# Altium schematic sheet Schema_Soldeerbout5.SchDoc
size A4; SheetNumber: 6; SheetTotal: 6
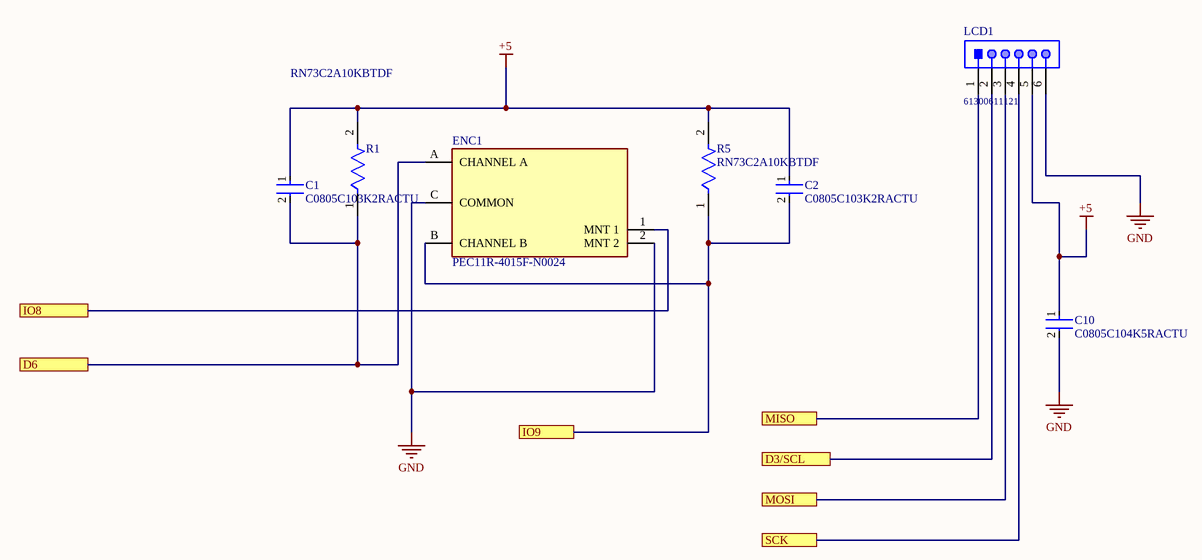
[diagram p0: Schema_Soldeerbout5.SchDoc]

## Parts
C1  C0805C103K2RACTU  [FP-C0805C-DN-MFG]
C2  C0805C103K2RACTU  [FP-C0805C-DN-MFG]
C10  C0805C104K5RACTU  [FP-C0805C-DN-MFG]
ENC1  PEC11R-4015F-N0024  [FP-PEC11R-4015F-N0024-MFG]
LCD1  61300611121  [61300611121]
R1  RN73C2A10KBTDF  [FP-RN732A-MFG]
R5  RN73C2A10KBTDF  [FP-RN732A-MFG]

## Ports
D3/SCL, D6, IO8, IO9, MISO, MOSI, SCK

## Nets
+5: C1.1 C2.1 C10.1 LCD1.5 R1.2 R5.2
GND: C10.2 ENC1.2(MNT_2) ENC1.C(COMMON) LCD1.6
D3/SCL: LCD1.2 ; port D3/SCL
D6: C1.2 ENC1.A(CHANNEL_A) R1.1 ; port D6
IO8: ENC1.1(MNT_1) ; port IO8
IO9: C2.2 ENC1.B(CHANNEL_B) R5.1 ; port IO9
MISO: LCD1.1 ; port MISO
MOSI: LCD1.3 ; port MOSI
SCK: LCD1.4 ; port SCK

## Library data of the parts
C1 C2 = CMP-2007-00259-2: CAP CER 10000PF 200V X7R 0805; Manufacturer: KEMET; Material: Ceramic; Temperature Coefficient: 30ppm/°C; Capacitance: 10,000 pF; Tolerance: 0.1; Value: 10,000 pF; Device Class L2: Capacitors; Voltage Rating: 200 V; Temperature Range High: +125°C; ComponentLink2Description: Datasheet; Height: 0.88mm; Octopart: https://octopart.com/c0805c103k2ractu-kemet-9138347; ComponentLink2URL: https://content.kemet.com/datasheets/KEM_C1003_C0G_SMD.pdf; Category: Cap; Temperature: -55°C to +125°C; Temperature Range Low: -55°C; Digikey Description: CAP CER 10000PF 200V X7R 0805; Manufacturer Part Number: C0805C103K2RACTU; Temperature Characteristic: X7R; Automotive: No; Device Class L3: Ceramic Capacitors; Mouser Description: KEMET - C0805C103K2RACTU - CAP, MLCC, X7R, 10NF, 200V, 0805; RoHS: TRUE; Device Class L1: Passive Components; Lead Free: Yes; Package: C0805C-DN; Ipc Land Pattern Name: CAPC200125X78
C10 = CMP-2007-00279-2: CAP CER 0.1UF 50V X7R 0805; Manufacturer: KEMET; Value: 0.10 μF; Tolerance: 0.1; Temperature Coefficient: 30ppm/°C; Material: Ceramic; Manufacturer Part Number: C0805C104K5RACTU; Device Class L2: Capacitors; Temperature Range Low: -55°C; Voltage Rating: 50 V; Digikey Description: CAP CER 0.1UF 50V X7R 0805; Category: Cap; ComponentLink2Description: Datasheet; Octopart: https://octopart.com/c0805c104k5ractu-kemet-143926; RoHS: TRUE; ComponentLink2URL: https://content.kemet.com/datasheets/KEM_C1003_C0G_SMD.pdf; Temperature Characteristic: X7R; Temperature: -55°C to +125°C; Height: 0.88mm; Temperature Range High: +125°C; Device Class L1: Passive Components; Automotive: No; Lead Free: Yes; Ipc Land Pattern Name: CAPC200125X78; Device Class L3: Ceramic Capacitors; Mouser Description: Cap Ceramic 0.1uF 50V X7R 10% SMD 2.0 x 1.2 mm 125 C Paper T/R; Capacitance: 0.10 μF; Package: C0805C-DN
ENC1 = CMP-07421-000003-1: ROTARY ENCODER MECHANICAL 24PPR; Manufacturer: Bourns; Current Rating: 10mA; Number Of Circuits: 1; Conn Orientation: Vertical; Encoder Type: Incremental; Detent: No; Pulses Per Rev: 24; Voltage Rating Dc: 5V; Manufacturer Part Number: PEC11R-4015F-N0024; Height: 22.3mm; ComponentLink2URL: https://www.bourns.com/docs/product-datasheets/pec11r.pdf?sfvrsn=bb617cbf_7; Mouser Description: Encoders 15mm SHAFT NO SWITCH; Package: 0; RoHS: TRUE; Temperature Range High: +70°C; Device Class L1: Electromechanical; Device Class L3: Encoders; Temperature Range Low: -30°C; Device Class L2: Switches; Temperature: -30°C to +70°C; Category: Enc; ComponentLink2Description: Datasheet; Lead Free: Yes; Automotive: No; Octopart: https://octopart.com/pec11r-4015f-n0024-bourns-26648251; Digikey Description: ROTARY ENCODER MECHANICAL 24PPR
LCD1 = CMP-1502-01070-1: THT Vertical Pin Header WR-PHD, Pitch 2.54 mm, Single Row, 6 pins; Manufacturer: Wurth Elektronik; Gender: Male; Pin Number: 6; Pitch: 2.54mm; Working Voltage: 250VAC; Rated Current: 3A; Withstanding Voltage: 500VAC; Contact Resistance: 20mOhm; Operating Temperature: -40to105degC; Packaging: Bag; Datasheet URL: https://katalog.we-online.de/em/datasheet/6130xx11121.pdf; Package Reference: 61300611121; Mounting Technology: THT; Publisher: WurthElektronik; Part Number: 61300611121; Manufacturer URL: http://www.we-online.de; Row Number: Single; Orientation: Vertical
R1 R5 = CMP-03211-000130-1: SMD Chip Resistor, Thin Film, 10KΩ, 100 V, 0805 [2012 Metric], 100 mW, 0.1%, RN73 Series; Manufacturer: TE Connectivity; Power Rating: 0.1W; Temperature Coefficient: 10ppm/°C; Voltage Rating: 100V; Package: RN732A; Ipc Land Pattern Name: RESC200125X55; RoHS: TRUE; packaging: 1000 Reel; Resistance: 10KΩ; Octopart: https://octopart.com/rn73c2a10kbtdf-te+connectivity-21400356; Temperature Range Low: -55°C; Device Class L1: Passive Components; Tolerance: 0.1%; ComponentLink2URL: https://www.te.com/commerce/DocumentDelivery/DDEController?Action=showdoc&DocId=Data+Sheet%7F1773270%7FP%7Fpdf%7FEnglish%7FENG_DS_1773270_P.pdf%7F1676162-2; Height: 0.65mm; Composition: Thin Film; Temperature Range High: 155°C; Automotive: No; Series: RN73; Lead Free: Yes; Value: 10KΩ; Category: Res; Device Class L2: Resistors; Temperature: -55°C to 155°C; octopart_url: https://octopart.com/rn73c2a10kbtdf-te+connectivity-21400356; Device Class L3: Chip SMD Resistors; ComponentLink2Description: Datasheet; Manufacturer Part Number: RN73C2A10KBTDF